# EAGLE design Arduino_Nanolu_Kart_2 (EAGLE 9.6.1)
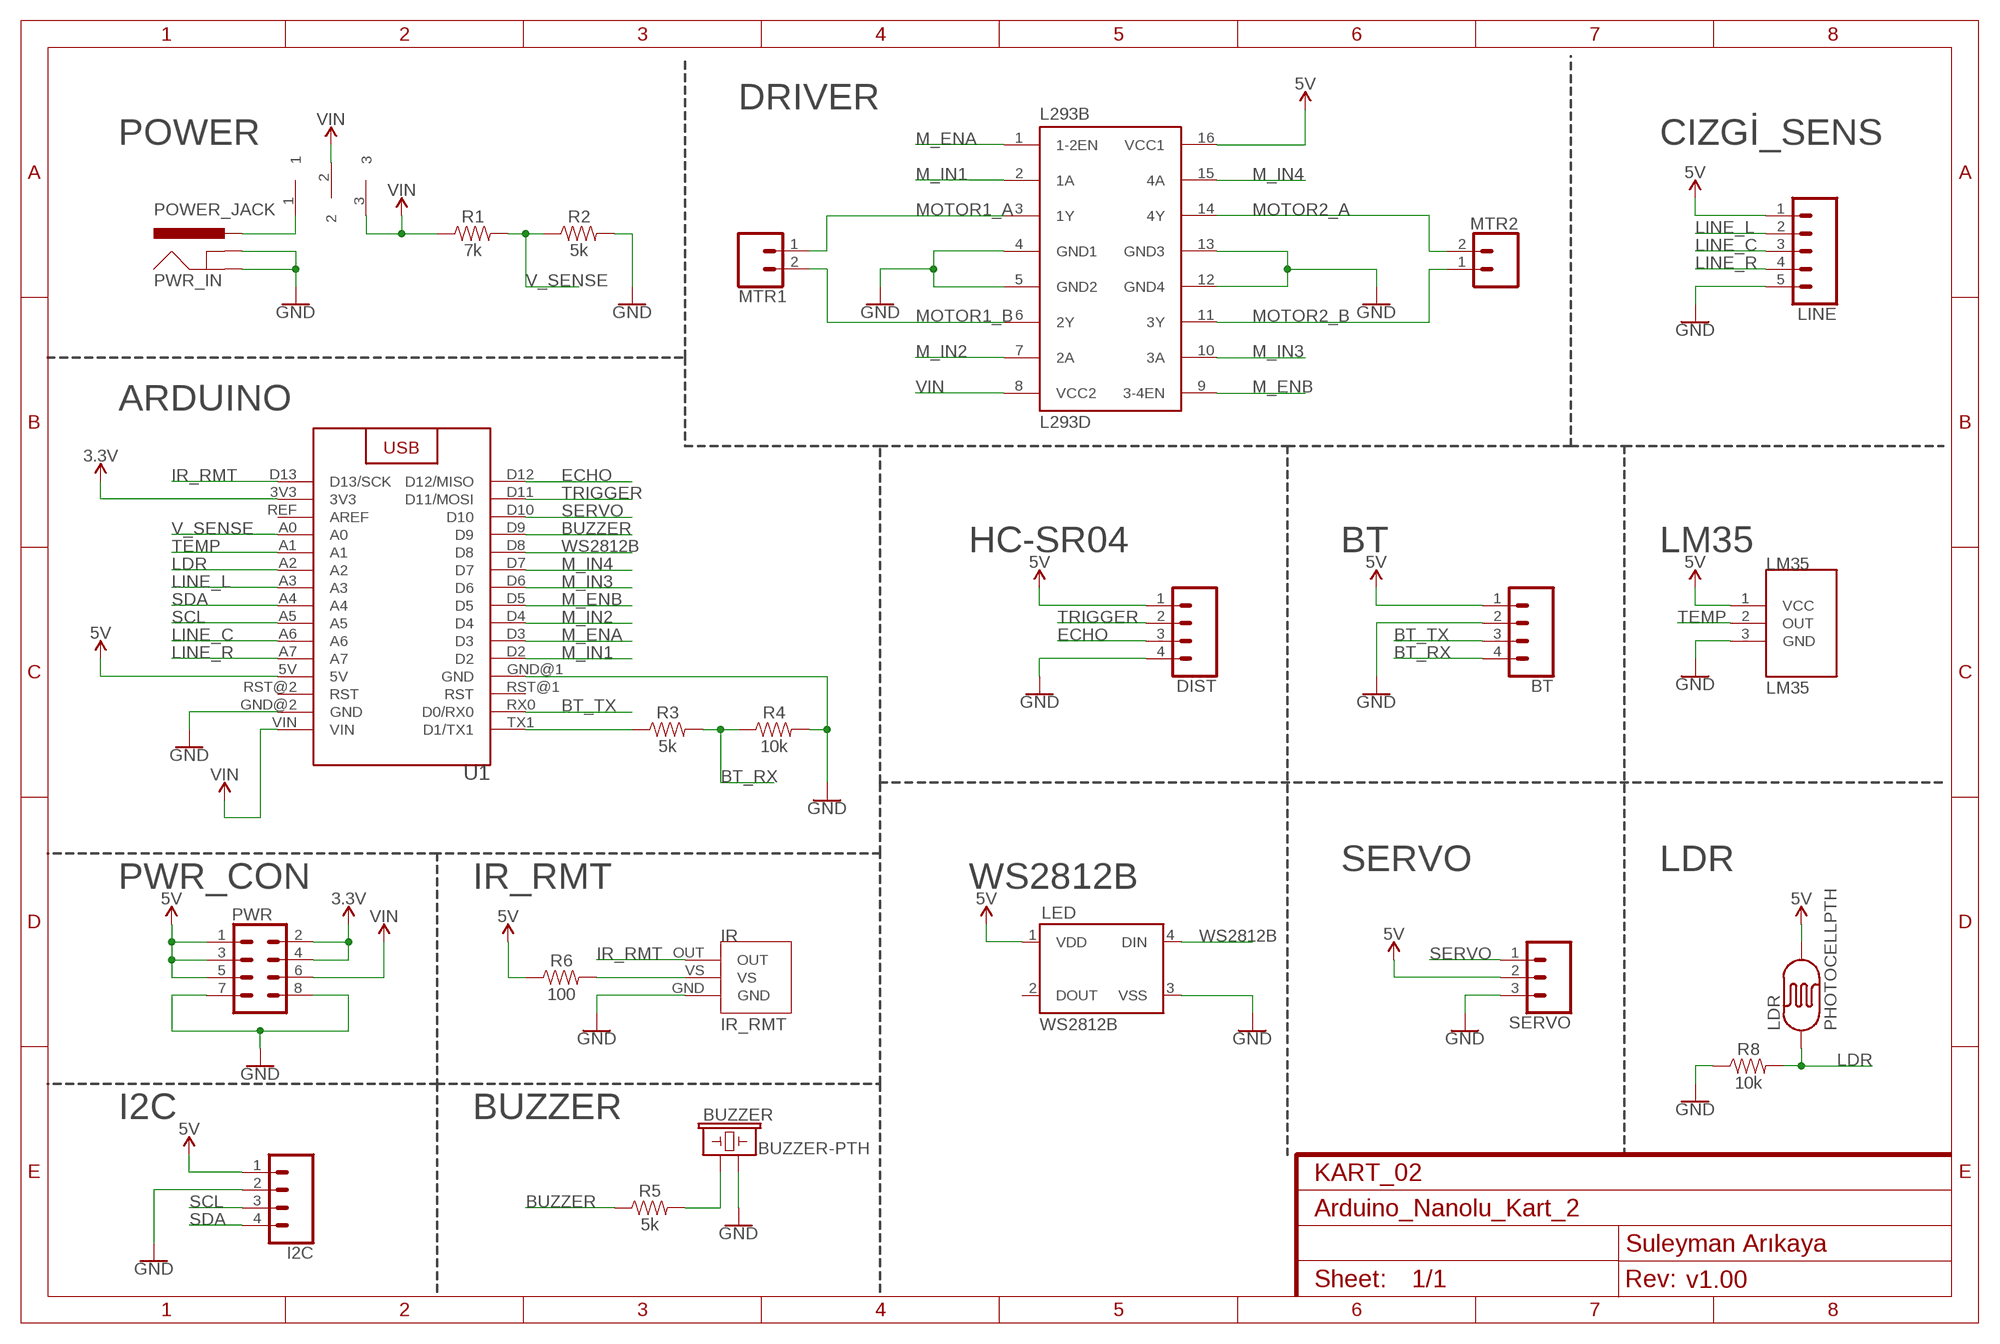
[diagram p0: schematic, sheet 1]
FRAME1 (FRAME-A4L): CNAME: KART_02; CREVISION: v1.00; DESIGNER: Suleyman Arıkaya

## Parts
BT  CONN_04  [1X04]
BUZZER  BUZZER-PTH  [BUZZER-12MM]
DIST  CONN_04  [1X04]
I2C  CONN_04  [1X04]
IR  IR_RMT  IR_SENSOR  [IR_SENSOR]
L293B  L293D  [DIL16]
LDR  PHOTOCELLPTH  [PHOTOCELL]
LED  WS2812B  [WS2812B]
LINE  CONN_05  [1X05]
LM35  LM35  [TO-92]
MTR1  CONN_023.5MM  [SCREWTERMINAL-3.5MM-2]
MTR2  CONN_023.5MM  [SCREWTERMINAL-3.5MM-2]
PWR  CONN_04X2  [2X4]
PWR_IN  POWER_JACK  [POWER_JACK_PTH]
R1  7k  1KOHM-HORIZ-1/4W-5%  [AXIAL-0.3]
R2  5k  1KOHM-HORIZ-1/4W-5%  [AXIAL-0.3]
R3  5k  1KOHM-HORIZ-1/4W-5%  [AXIAL-0.3]
R4  10k  1KOHM-HORIZ-1/4W-5%  [AXIAL-0.3]
R5  5k  1KOHM-HORIZ-1/4W-5%  [AXIAL-0.3]
R6  100  1KOHM-HORIZ-1/4W-5%  [AXIAL-0.3]
R8  10k  1KOHM-HORIZ-1/4W-5%  [AXIAL-0.3]
SERVO  CONN_03  [1X03]
SWICH  SWICH_X2_3MM  [SWICH_X2_3MM]
U1  ARDUINO_NANO  [ARDUINO_NANO]

## Nets
3.3V: PWR.2 PWR.4 U1.3V3
5V: BT.1 DIST.1 I2C.1 L293B.16(VCC1) LDR.2 LED.1(VDD) LINE.1 LM35.1(VCC) PWR.1 PWR.3 PWR.5 R6.P$1 SERVO.2 U1.5V
BT_RX: BT.4 R3.P$2 R4.P$1
BT_TX: BT.3 U1.RX0(D0/RX0)
BUZZER: R5.P$1 U1.D9
ECHO: DIST.3 U1.D12(D12/MISO)
GND: BT.2 BUZZER.- DIST.4 I2C.2 IR.GND L293B.4(GND1) L293B.5(GND2) L293B.12(GND4) L293B.13(GND3) LED.3(VSS) LINE.5 LM35.3(GND) PWR.7 PWR.8 PWR_IN.GND PWR_IN.GNDBREAK R2.P$2 R4.P$2 R8.P$1 SERVO.3 U1.GND@1(GND) U1.GND@2(GND)
IR_RMT: IR.OUT U1.D13(D13/SCK)
LDR: LDR.1 R8.P$2 U1.A2
LINE_C: LINE.3 U1.A6
LINE_L: LINE.2 U1.A3
LINE_R: LINE.4 U1.A7
M_ENA: L293B.1(1-2EN) U1.D3
M_ENB: L293B.9(3-4EN) U1.D5
M_IN1: L293B.2(1A) U1.D2
M_IN2: L293B.7(2A) U1.D4
M_IN3: L293B.10(3A) U1.D6
M_IN4: L293B.15(4A) U1.D7
MOTOR1_A: L293B.3(1Y) MTR1.1
MOTOR1_B: L293B.6(2Y) MTR1.2
MOTOR2_A: L293B.14(4Y) MTR2.2
MOTOR2_B: L293B.11(3Y) MTR2.1
N$1: R3.P$1 U1.TX1(D1/TX1)
N$2: BUZZER.+ R5.P$2
N$3: IR.VS R6.P$2
N$4: PWR_IN.PWR SWICH.1
SCL: I2C.3 U1.A5
SDA: I2C.4 U1.A4
SERVO: SERVO.1 U1.D10
TEMP: LM35.2(OUT) U1.A1
TRIGGER: DIST.2 U1.D11(D11/MOSI)
V_SENSE: R1.P$2 R2.P$1 U1.A0
VIN: L293B.8(VCC2) PWR.6 R1.P$1 SWICH.2 SWICH.3 U1.VIN
WS2812B: LED.4(DIN) U1.D8
Unconnected: LED.2(DOUT) U1.REF(AREF) U1.RST@1(RST) U1.RST@2(RST)

## Notes on the sheet
- DRIVER
- POWER | CIZGİ_SENS
- ARDUINO
- HC-SR04 | BT | LM35
- SERVO | LDR
- PWR_CON | IR_RMT | WS2812B
- I2C | BUZZER

## Library data of the parts
BT DIST I2C = SparkFun-Connectors:CONN_04: Multi connection point. Often used as Generic Header-pin footprint for 0.1 inch spaced/style header connections On any of the 0.1 inch spaced packages, you can populate with these: Break Away Headers - Straight <https://www.sparkfun.com/products/116> (PRT-00116) Break Away Male Headers - Right Angle <https://www.sparkfun.com/products/553> (PRT-00553) Female Headers <https://www.sparkfun.com/products/115> (PRT-00115) Break Away Headers - Machine Pin <https://www.sparkfun.com/products/117> (PRT-00117) Break Away Female Headers - Swiss Machine Pin <https://www.sparkfun.com/products/743> (PRT-00743) For SCREWTERMINALS and SPRING TERMINALS visit here: Screw Terimnals on SparkFun.com <https://www.sparkfun.com/search/results?term=Screw+Terminals> (5mm/3.5mm/2.54mm spacing) This device is also useful as a general connection point to wire up your design to another part of your project. Our various solder wires solder well into these plated through hole pads. Hook-Up Wire - Assortment (Stranded, 22 AWG) <https://www.sparkfun.com/products/11375> (PRT-11375) Hook-Up Wire - Assortment (Solid Core, 22 AWG) <https://www.sparkfun.com/products/11367> (PRT-11367) View the entire wire category on our website here <https://www.sparkfun.com/categories/141> Special notes: Molex polarized connector foot print use with SKU : PRT-08231 with associated crimp pins and housings. 1MM SMD Version SKU: PRT-10208; PROD_ID: CONN-09696
BUZZER = SparkFun-Electromechanical:BUZZER: Buzzer Small round buzzers that operate around the audible 2kHz range. You can use these as speakers to create simple music or user interfaces. Variant Overview: PTH - Mini Speaker - PC Mount 12mm 2.048kHz <https://www.sparkfun.com/products/7950> PTH_KIT - Mini Speaker - PC Mount 12mm 2.048kHz <https://www.sparkfun.com/products/7950> KIT simplifies soldering by adding stop mask to one side of the pads. PTH_NO_SILK - Mini Speaker - PC Mount 12mm 2.048kHz <https://www.sparkfun.com/products/7950> No silkscreen indicator of buzzer outline. PTH_KIT_NO_SILK - Mini Speaker - PC Mount 12mm 2.048kHz <https://www.sparkfun.com/products/7950> KIT package w/o silkscreen SMD - Buzzer Audio Magnetic (CCV-084B16) SMD buzzer used on, e.g. the LilyPad Buzzer <https://www.sparkfun.com/products/8463> and RFID USB Reader <https://www.sparkfun.com/products/9963>. SMD_KIT - Buzzer Audio Magnetic (CCV-084B16) SMD Buzzer with elongated pins to make soldering easier. Used on the SparkFun Simon Says - Surface Mount Soldering Kit <https://www.sparkfun.com/products/10935>.; PROD_ID: COMP-08253; SF_SKU: COM-07950
IR = Arikaya_lib:IR_SENSOR
L293B = st-microelectronics:L293D: PUSH-PULL 4 CHANNEL DRIVER; MPN: L293D; OC_FARNELL: 9589619; OC_NEWARK: 56P8249
LDR = SparkFun:PHOTOCELL: Photocell Also known as a CdS photoresistor. This is a low cost way to detect light levels. Resistance decreases with more incoming light. SparkFun SKU: SEN-09088
LED = SparkFun-LED:WS2812B: WS2812B - Intelligent control LED integrated light source Technical Specifications: Power Supply Voltage (VDD): 3.5 to 5.3 V Input Voltage (VI): -0.5 to VDD+0.5 V Operating Junction Temperature (Topt): -25°C to +80°C Storage Temperature Range (Tstg): -55°C to +150°C; PROD_ID: DIO-12503
LINE = SparkFun-Connectors:CONN_05: Multi connection point. Often used as Generic Header-pin footprint for 0.1 inch spaced/style header connections On any of the 0.1 inch spaced packages, you can populate with these: Break Away Headers - Straight <https://www.sparkfun.com/products/116> (PRT-00116) Break Away Male Headers - Right Angle <https://www.sparkfun.com/products/553> (PRT-00553) Female Headers <https://www.sparkfun.com/products/115> (PRT-00115) Break Away Headers - Machine Pin <https://www.sparkfun.com/products/117> (PRT-00117) Break Away Female Headers - Swiss Machine Pin <https://www.sparkfun.com/products/743> (PRT-00743) For SCREWTERMINALS and SPRING TERMINALS visit here: Screw Terimnals on SparkFun.com <https://www.sparkfun.com/search/results?term=Screw+Terminals> (5mm/3.5mm/2.54mm spacing) This device is also useful as a general connection point to wire up your design to another part of your project. Our various solder wires solder well into these plated through hole pads. Hook-Up Wire - Assortment (Stranded, 22 AWG) <https://www.sparkfun.com/products/11375> (PRT-11375) Hook-Up Wire - Assortment (Solid Core, 22 AWG) <https://www.sparkfun.com/products/11367> (PRT-11367) View the entire wire category on our website here <https://www.sparkfun.com/categories/141> Special notes: Molex polarized connector foot print use with SKU : PRT-08231 with associated crimp pins and housings. 1MM SMD Version SKU: PRT-10208
LM35 = Arikaya_lib:LM35; SPICEPREFIX: U
MTR1 MTR2 = SparkFun-Connectors:CONN_02: Multi connection point. Often used as Generic Header-pin footprint for 0.1 inch spaced/style header connections On any of the 0.1 inch spaced packages, you can populate with these: Break Away Headers - Straight <https://www.sparkfun.com/products/116> (PRT-00116) Break Away Male Headers - Right Angle <https://www.sparkfun.com/products/553> (PRT-00553) Female Headers <https://www.sparkfun.com/products/115> (PRT-00115) Break Away Headers - Machine Pin <https://www.sparkfun.com/products/117> (PRT-00117) Break Away Female Headers - Swiss Machine Pin <https://www.sparkfun.com/products/743> (PRT-00743) For SCREWTERMINALS and SPRING TERMINALS visit here: Screw Terimnals on SparkFun.com <https://www.sparkfun.com/search/results?term=Screw+Terminals> (5mm/3.5mm/2.54mm spacing) This device is also useful as a general connection point to wire up your design to another part of your project. Our various solder wires solder well into these plated through hole pads. Hook-Up Wire - Assortment (Stranded, 22 AWG) <https://www.sparkfun.com/products/11375> (PRT-11375) Hook-Up Wire - Assortment (Solid Core, 22 AWG) <https://www.sparkfun.com/products/11367> (PRT-11367) View the entire wire category on our website here <https://www.sparkfun.com/categories/141> Special notes: Molex polarized connector foot print use with: PRT-08233 with associated crimp pins and housings. 2.54_SCREWTERM for use with PRT-10571. 3.5mm Screw Terminal footprints for PRT-08084 5mm Screw Terminal footprints for use with PRT-08432; PROD_ID: CONN-08399
PWR = SparkFun-Connectors:CONN_04X2: Multi connection point. Often used as Generic Header-pin footprint for 0.1 inch spaced/style header connections On any of the 0.1 inch spaced packages, you can populate with these: Break Away Headers - Straight <https://www.sparkfun.com/products/116> (PRT-00116) Break Away Male Headers - Right Angle <https://www.sparkfun.com/products/553> (PRT-00553) Female Headers <https://www.sparkfun.com/products/115> (PRT-00115) Break Away Headers - Machine Pin <https://www.sparkfun.com/products/117> (PRT-00117) Break Away Female Headers - Swiss Machine Pin <https://www.sparkfun.com/products/743> (PRT-00743)
PWR_IN = SparkFun-Connectors:POWER_JACK: Power Jack Connector This is the standard 5.5mm barrel jack for power. The PTH is the most common, proven, reliable, footprint. The Slot footprint only works if the mill layer is transmitted to the PCB fab house so be warned. Here are the connectors we sell at SparkFun: DC Barrel Power Jack/Connector <https://www.sparkfun.com/products/119> (PRT-00119) DC Barrel Power Jack/Connector (SMD) <https://www.sparkfun.com/products/12748> (PRT-12748) DC Barrel Jack Adapter - Breadboard Compatible <https://www.sparkfun.com/products/10811> (PRT-10811) It is used on this SparkFun product (and many, many others): SparkFun RedBoard - Programmed with Arduino <https://www.sparkfun.com/products/12757> (DEV-12757) Also, if you need a mating power supply or connector, please check these out: Wall Adapter Power Supply - 9VDC 650mA <https://www.sparkfun.com/products/298> (TOL-00298) DC Barrel Jack Adapter - Male <https://www.sparkfun.com/products/10287> (PRT-10287); PROD_ID: CONN-08197
R1-R6 R8 = SparkFun-Resistors:1KOHM: 1kΩ resistor A resistor is a passive two-terminal electrical component that implements electrical resistance as a circuit element. Resistors act to reduce current flow, and, at the same time, act to lower voltage levels within circuits. - Wikipedia; PROD_ID: RES-08380; VALUE: 1k
SERVO = SparkFun-Connectors:CONN_03: Multi connection point. Often used as Generic Header-pin footprint for 0.1 inch spaced/style header connections On any of the 0.1 inch spaced packages, you can populate with these: Break Away Headers - Straight <https://www.sparkfun.com/products/116> (PRT-00116) Break Away Male Headers - Right Angle <https://www.sparkfun.com/products/553> (PRT-00553) Female Headers <https://www.sparkfun.com/products/115> (PRT-00115) Break Away Headers - Machine Pin <https://www.sparkfun.com/products/117> (PRT-00117) Break Away Female Headers - Swiss Machine Pin <https://www.sparkfun.com/products/743> (PRT-00743) Stackable Header - 3 Pin (Female, 0.1") <https://www.sparkfun.com/products/13875> (PRT-13875) For SCREWTERMINALS and SPRING TERMINALS visit here: Screw Terimnals on SparkFun.com <https://www.sparkfun.com/search/results?term=Screw+Terminals> (5mm/3.5mm/2.54mm spacing) This device is also useful as a general connection point to wire up your design to another part of your project. Our various solder wires solder well into these plated through hole pads. Hook-Up Wire - Assortment (Stranded, 22 AWG) <https://www.sparkfun.com/products/11375> (PRT-11375) Hook-Up Wire - Assortment (Solid Core, 22 AWG) <https://www.sparkfun.com/products/11367> (PRT-11367) View the entire wire category on our website here <https://www.sparkfun.com/categories/141> Special notes: Molex polarized connector foot print use with SKU : PRT-08232 with associated crimp pins and housings.
SWICH = Arikaya_lib:SWICH_X2_3MM
U1 = Arikaya_lib:ARDUINO_NANO: Arduino Nano Devices

## Board
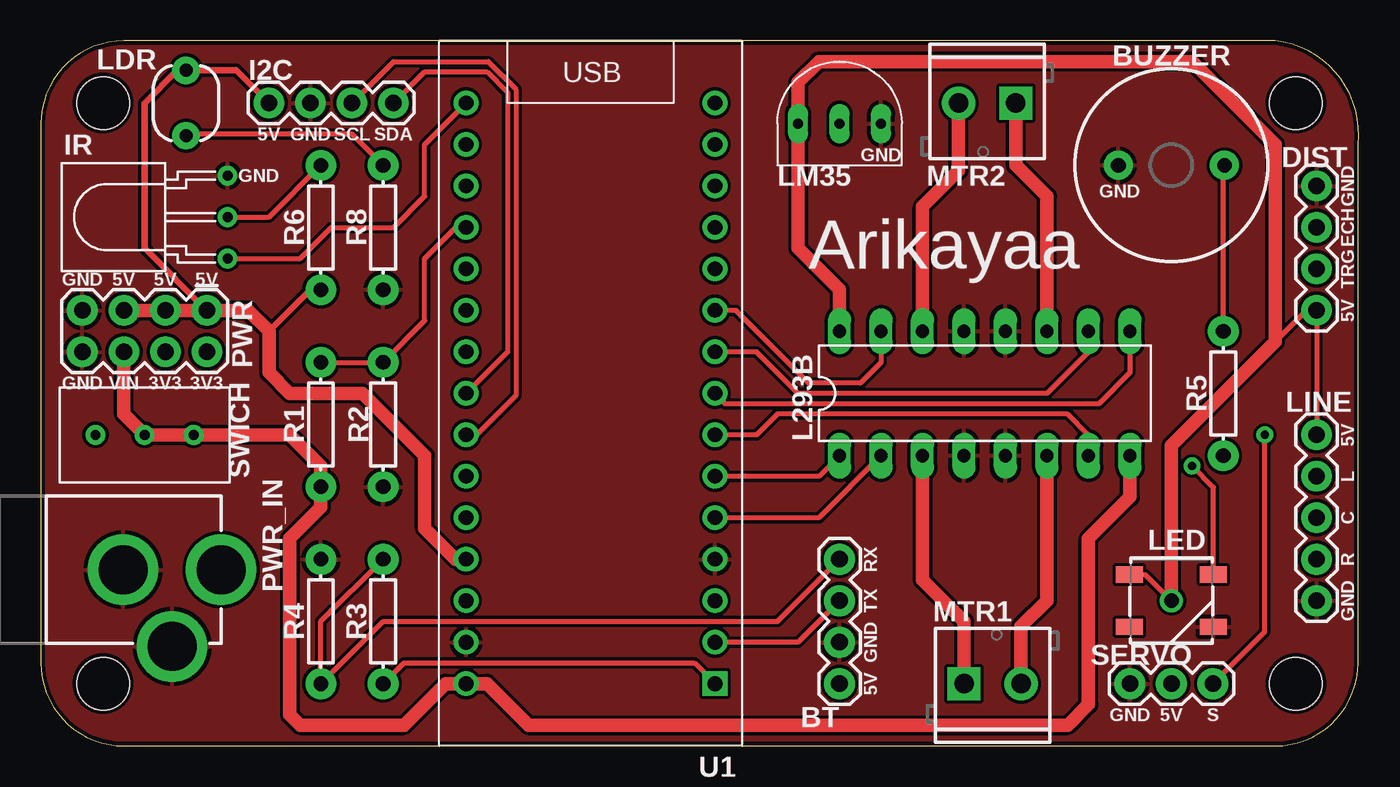
[diagram p1: board, top side]
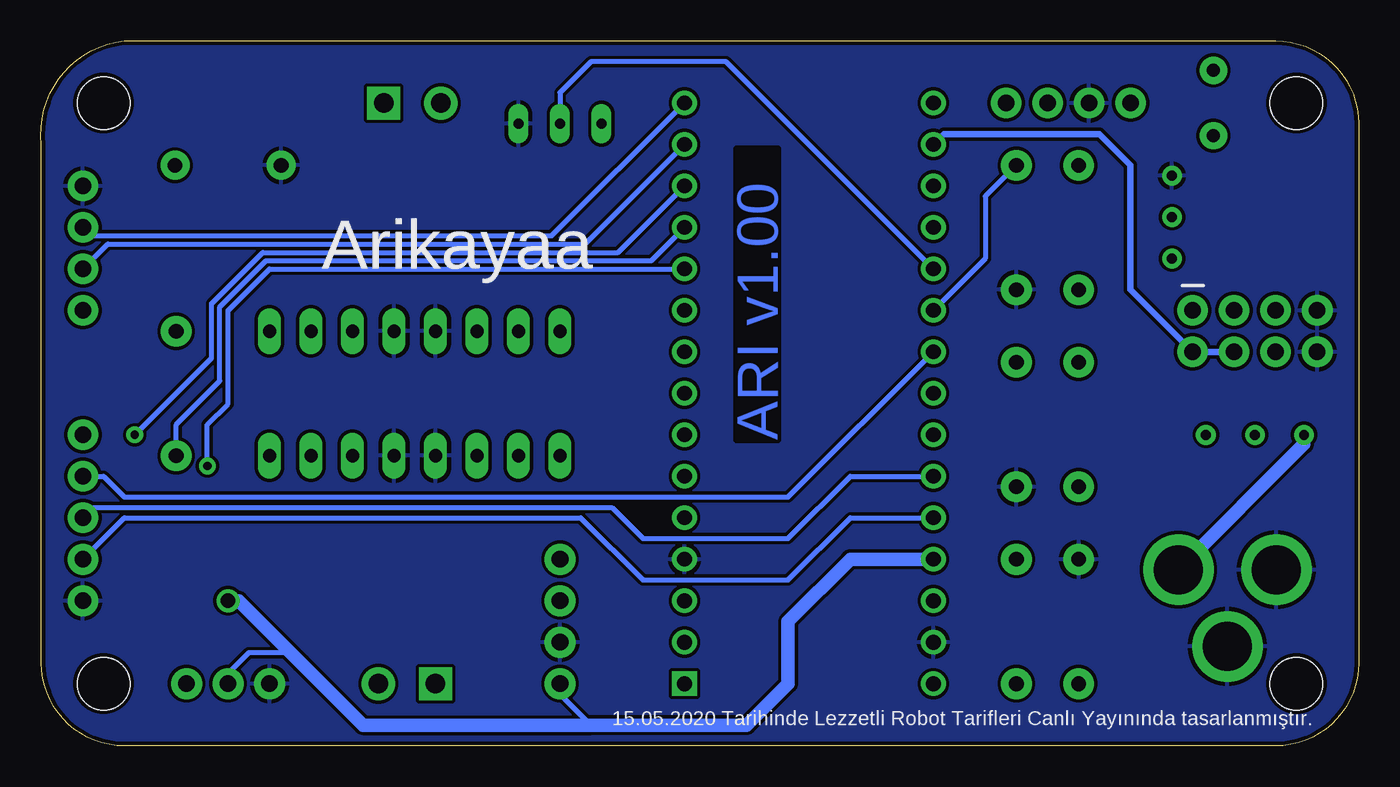
[diagram p2: board, bottom side, seen from below]

Size 80.68 x 43.18 mm. Coordinates in mm from the lower left corner, seen from the top.
Outline: 75.56,43.18 5.08,43.18 arc90 0,38.1 0,5.08 arc90 5.08,0 75.56,0 arc90 80.64,5.08 80.64,36.83 arc90 75.56,43.18
Copper layers (1*16): Top 0.035mm / dielectric 1.5mm / Bottom 0.035mm
Design rules "SparkFun": minimum track width 8mil, minimum drill 20mil, track to track 8mil, track to pad 8mil, pad to pad 8mil, via to via 8mil, smd to smd 8mil, copper to edge 10mil, drill to drill 8mil, minimum pad ring 12mil, minimum via ring 10mil, stop-mask expansion 4mil, vias tented up to drill 25mil, thermal gap 10mil
Holes 3.2 mm at 3.81,39.37 76.83,3.81 76.83,39.37 3.81,3.81

### Footprints (pad centres in the part's own frame; a part is rotated, then mirrored left to right if it is on the bottom)
1X04 = drill 1.016 pad 1.88: 1 0,0; 2 2.54,0; 3 5.08,0; 4 7.62,0
BUZZER-12MM = drill 0.9 pad 1.778: + 3.25,0; - -3.25,0
IR_SENSOR = drill 0.6: GND 2.54,0; OUT -2.54,0; VS 0,0
DIL16 = drill 0.813 long: 1 -8.89,-3.81; 2 -6.35,-3.81; 3 -3.81,-3.81; 4 -1.27,-3.81; 5 1.27,-3.81; 6 3.81,-3.81; 7 6.35,-3.81; 8 8.89,-3.81; 9 8.89,3.81; 10 6.35,3.81; 11 3.81,3.81; 12 1.27,3.81; 13 -1.27,3.81; 14 -3.81,3.81; 15 -6.35,3.81; 16 -8.89,3.81
PHOTOCELL = drill 0.8 pad 1.676: 1 -2,0; 2 2,0
WS2812B = smd 1.651 x 1: 1 -2.577,1.6; 2 -2.577,-1.6; 3 2.577,-1.6; 4 2.577,1.6
1X05 = drill 1.016 pad 1.88: 1 0,0; 2 2.54,0; 3 5.08,0; 4 7.62,0; 5 10.16,0
TO-92 = drill 0.6 long: 1 -2.54,0; 2 0,0; 3 2.54,0
SCREWTERMINAL-3.5MM-2 = drill 1.2 pad 2.032 square: 1 0,0 | drill 1.2 pad 2.032: 2 3.5,0
2X4 = drill 1.016 pad 1.88: 1 -3.81,-1.27; 2 -3.81,1.27; 3 -1.27,-1.27; 4 -1.27,1.27; 5 1.27,-1.27; 6 1.27,1.27; 7 3.81,-1.27; 8 3.81,1.27
POWER_JACK_PTH = drill 2.997 pad 4.318: GND 0,7.7; GNDBREAK 4.7,10.7; PWR 0,13.7
AXIAL-0.3 = drill 0.9 pad 1.88: P$1 -3.81,0; P$2 3.81,0
1X03 = drill 1.016 pad 1.88: 1 0,0; 2 2.54,0; 3 5.08,0
SWICH_X2_3MM = drill 0.6: 1 -3,0; 2 0,0; 3 3,0
ARDUINO_NANO = drill 0.9: 3V3 7.62,-15.24; 5V 7.62,10.16; A0 7.62,-10.16; A1 7.62,-7.62; A2 7.62,-5.08; A3 7.62,-2.54; A4 7.62,0; A5 7.62,2.54; A6 7.62,5.08; A7 7.62,7.62; D2 -7.62,7.62; D3 -7.62,5.08; D4 -7.62,2.54; D5 -7.62,0; D6 -7.62,-2.54; D7 -7.62,-5.08; D8 -7.62,-7.62; D9 -7.62,-10.16; D10 -7.62,-12.7; D11 -7.62,-15.24; D12 -7.62,-17.78; D13 7.62,-17.78; GND@1 -7.62,10.16; GND@2 7.62,15.24; REF 7.62,-12.7; RST@1 -7.62,12.7; RST@2 7.62,12.7; RX0 -7.62,15.24; VIN 7.62,17.78 | drill 0.9 square: TX1 -7.62,17.78

### Placement (x,y rotation side)
BT  48.9,3.81 90 top
BUZZER  69.22,35.56 0 top
DIST  78.11,26.67 90 top
I2C  13.97,39.37 0 top
IR  11.43,32.38 90 top
L293B  57.78,21.59 0 top
LDR  8.89,39.37 90 top
LED  69.22,8.89 0 top
LINE  78.11,19.05 270 top
LM35  48.9,38.1 0 top
MTR1  56.52,3.81 0 top
MTR2  59.69,39.37 180 top
PWR  6.35,25.4 180 top
PWR_IN  -2.67,10.79 270 top
R1  17.14,19.68 90 top
R2  20.95,19.68 270 top
R3  20.95,7.62 90 top
R4  17.14,7.62 90 top
R5  72.39,21.59 90 top
R6  17.14,31.75 90 top
R8  20.95,31.75 90 top
SERVO  71.75,3.81 180 top
SWICH  6.35,19.05 0 top
U1  33.66,21.59 180 top

### Tracks (layer width: path | path; a pad name or v marks a point on that pad's centre or on a via)
3.3V
  Bottom 0.406: PWR.4 PWR.2 13.97,27.94 13.97,35.56 15.88,37.47 25.4,37.47 U1.3V3
5V  (via drill 0.89)
  Top 0.305: v69.22,8.89 67.61,10.49 LED.1 | 75.56,24.77 77.47,26.67 DIST.1 LINE.1
  Top 0.406: PWR.1 6.35,30.48 6.35,39.37 8.35,41.37 LDR.2 11.97,41.37 I2C.1 | 13.97,25.4 16.51,27.94 R6.P$1
  Top 0.813: L293B.16 48.9,27.94 46.35,30.48 LM35.1 46.35,40.64 47.62,41.91 70.48,41.91 75.56,36.83 75.56,24.77 69.22,18.41 v69.22,8.89 | U1.5V 25.4,11.43 23.5,13.34 23.5,17.78 19.68,21.59 15.24,21.59 13.97,22.86 13.97,25.4 12.7,26.67 PWR.1 PWR.3 PWR.5
  Bottom 0.305: 46.99,1.27 48.9,3.17 BT.1 | 64.77,5.08 65.41,5.71 67.94,5.71 69.22,4.45 SERVO.2
  Bottom 0.813: U1.5V 31.11,11.43 34.92,7.62 34.92,3.81 37.47,1.27 46.99,1.27 60.96,1.27 64.77,5.08 68.58,8.89 v69.22,8.89
BT_RX
  Top 0.305: BT.4 45.09,7.62 20.95,7.62 R4.P$1 17.14,7.62 R3.P$2
BT_TX
  Top 0.305: BT.3 46.35,6.35 U1.RX0
BUZZER
  Bottom 0.305: R5.P$1 72.39,19.68 69.72,22.35 69.72,26.88 66.89,29.72 43.31,29.72 U1.D9
ECHO
  Bottom 0.305: DIST.3 77.6,31.24 49.4,31.24 U1.D12
GND
  pour Top: -2.54,45.72 -2.54,-2.54 83.19,-2.54 83.19,45.72
  pour Bottom: -5.08,48.26 -5.08,-5.08 85.72,-5.08 85.72,48.26
IR_RMT
  Top 0.305: IR.OUT 15.88,29.84 17.78,31.75 21.59,31.75 23.5,33.66 23.5,36.83 U1.D13
LDR
  Top 0.305: R8.P$2 19.05,37.47 | 8.98,37.47 LDR.1 | 19.05,37.47 8.98,37.47 | 19.05,37.47 8.98,37.47
  Bottom 0.305: R8.P$2 22.86,33.66 22.86,29.84 U1.A2
LINE_C
  Bottom 0.305: LINE.3 77.47,14.61 45.72,14.61 43.81,12.7 34.92,12.7 31.11,16.51 U1.A6
LINE_L
  Bottom 0.305: LINE.2 76.83,16.51 75.56,15.24 34.92,15.24 U1.A3
LINE_R
  Bottom 0.305: LINE.4 75.56,13.97 47.62,13.97 43.81,10.16 34.92,10.16 31.11,13.97 U1.A7
M_ENA
  Top 0.305: L293B.1 47.62,16.51 U1.D3
M_ENB
  Top 0.305: L293B.9 66.67,22.86 64.77,20.95 41.91,20.95 U1.D5
M_IN1
  Top 0.305: L293B.2 47.62,13.97 U1.D2
M_IN2
  Top 0.305: L293B.7 64.14,19.05 62.87,20.32 45.09,20.32 43.81,19.05 U1.D4
M_IN3
  Top 0.305: L293B.10 64.14,24.13 61.59,21.59 46.35,21.59 43.81,24.13 U1.D6
M_IN4
  Top 0.305: L293B.15 51.44,23.5 50.16,22.23 46.99,22.23 42.55,26.67 U1.D7
MOTOR1_A
  Top 0.813: L293B.3 53.98,10.16 56.52,7.62 MTR1.1
MOTOR1_B
  Top 0.813: L293B.6 61.59,8.89 60.02,7.31 MTR1.2
MOTOR2_A
  Top 0.813: L293B.14 53.98,33.02 56.19,35.23 MTR2.2
MOTOR2_B
  Top 0.813: MTR2.1 59.69,35.56 61.59,33.66 L293B.11
N$1
  Top 0.305: U1.TX1 40.01,5.08 22.23,5.08 R3.P$1
N$2
  Top 0.305: R5.P$2 72.39,35.48 BUZZER.+
N$3
  Top 0.305: IR.VS 13.97,32.38 R6.P$2
N$4
  Bottom 0.813: SWICH.1 3.35,18.48 PWR_IN.PWR
SCL
  Top 0.305: I2C.3 21.59,41.91 27.39,41.91 29.08,40.22 29.08,21.46 26.67,19.05 U1.A5
SDA
  Top 0.305: I2C.4 23.5,41.27 27.3,41.27 28.57,40.01 28.57,24.13 U1.A4
SERVO  (via drill 0.51)
  Top 0.305: v74.93,19.05 74.93,8.89 74.93,6.99 SERVO.1
  Bottom 0.305: v74.93,19.05 70.23,23.75 70.23,27.09 67.1,30.23 45.34,30.23 U1.D10
TEMP
  Bottom 0.305: U1.A1 38.73,41.91 46.99,41.91 48.9,40.01 LM35.2
TRIGGER
  Bottom 0.305: DIST.2 76.58,30.73 47.37,30.73 U1.D11
V_SENSE
  Top 0.305: R1.P$2 R2.P$1 23.5,26.04 23.5,29.84 25.4,31.75 U1.A0
VIN
  Top 0.813: PWR.6 5.08,20.32 SWICH.2 SWICH.3 15.24,19.05 17.14,17.14 R1.P$1 17.14,14.61 15.24,12.7 15.24,1.91 15.88,1.27 22.23,1.27 24.77,3.81 U1.VIN 27.3,3.81 29.84,1.27 62.87,1.27 64.14,2.54 64.14,12.7 66.67,15.24 L293B.8
WS2812B  (via drill 0.51)
  Top 0.305: LED.4 71.79,15.84 v70.48,17.14
  Bottom 0.305: v70.48,17.14 70.48,19.68 69.22,20.95 69.22,26.67 66.67,29.21 U1.D8

### Text on the board
Bottom: ARI v1.00
tPlace: 5V | GND | SCL | SDA | GND | GND | GND | GND | ECH | GND | 5V | 5V | 5V | Arikayaa | TRG | 5V | GND | VIN | 3V3 | 3V3 | 5V | L | C | RX | R | TX | GND | GND | 5V | GND | 5V | S
bPlace: Arikayaa | 15.05.2020 Tarihinde Lezzetli Robot Tarifleri Canlı Yayınında tasarlanmıştır.
bStop: ARI v1.00